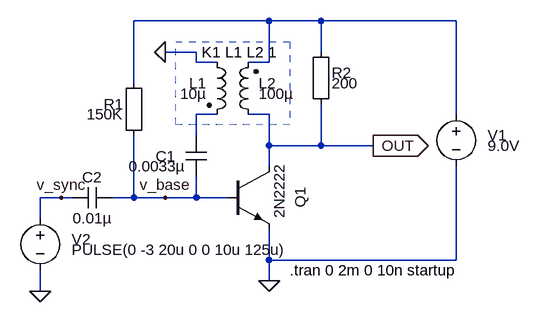
[diagram p0: schematic blocking_oscillator.asc]
blocking_oscillator.asc, the LTspice schematic file:
Version 4
SHEET 1 2412 680
WIRE 0 -1200 -208 -1200
WIRE 80 -1200 0 -1200
WIRE 288 -1200 80 -1200
WIRE -112 -1152 -160 -1152
WIRE 80 -1152 80 -1200
WIRE -112 -1136 -112 -1152
WIRE -80 -1136 -112 -1136
WIRE 0 -1136 0 -1200
WIRE 0 -1136 -32 -1136
WIRE -208 -1104 -208 -1200
WIRE -80 -1056 -112 -1056
WIRE 0 -1056 -32 -1056
WIRE 288 -1056 288 -1200
WIRE -112 -1024 -112 -1056
WIRE 0 -1008 0 -1056
WIRE 80 -1008 80 -1072
WIRE 80 -1008 0 -1008
WIRE 160 -1008 80 -1008
WIRE 0 -976 0 -1008
WIRE -320 -928 -352 -928
WIRE -304 -928 -320 -928
WIRE -208 -928 -208 -1024
WIRE -208 -928 -240 -928
WIRE -160 -928 -208 -928
WIRE -112 -928 -112 -960
WIRE -112 -928 -160 -928
WIRE -64 -928 -112 -928
WIRE -352 -896 -352 -928
WIRE 0 -832 0 -880
WIRE 288 -832 288 -976
WIRE 288 -832 0 -832
WIRE 0 -800 0 -832
WIRE -352 -784 -352 -816
FLAG 0 -800 0
FLAG 160 -1008 OUT
IOPIN 160 -1008 Out
FLAG -160 -1152 0
FLAG -160 -928 v_base
FLAG -352 -784 0
FLAG -320 -928 v_sync
SYMBOL voltage 288 -1072 R0
WINDOW 0 48 48 Left 2
WINDOW 3 48 64 Left 2
WINDOW 123 0 0 Left 2
WINDOW 39 0 0 Left 2
SYMATTR InstName V1
SYMATTR Value 9.0V
SYMBOL cap -128 -1024 R0
WINDOW 0 -16 32 Right 2
WINDOW 3 0 48 Right 2
SYMATTR InstName C1
SYMATTR Value 0.0033µ
SYMATTR SpiceLine V=16 Irms=182m Rser=1.32431 Lser=0 mfg="KEMET" pn="C0402C332K4RAC" type="X7R"
SYMBOL Misc\\EuropeanResistor -192 -1008 R180
WINDOW 0 32 64 Left 2
WINDOW 3 32 48 Left 2
SYMATTR InstName R1
SYMATTR Value 150K
SYMATTR SpiceLine tol=1 pwr=0.1
SYMBOL npn -64 -976 R0
WINDOW 0 112 64 VLeft 2
WINDOW 3 80 80 VLeft 2
SYMATTR InstName Q1
SYMATTR Value 2N2222
SYMBOL ind2 -96 -1152 R0
WINDOW 0 0 48 Right 2
WINDOW 3 0 64 Right 2
SYMATTR InstName L1
SYMATTR Value 10µ
SYMATTR Type ind
SYMBOL ind2 -16 -1040 R180
WINDOW 0 0 64 Right 2
WINDOW 3 0 48 Right 2
SYMATTR InstName L2
SYMATTR Value 100µ
SYMBOL Misc\\EuropeanResistor 96 -1056 R180
WINDOW 0 0 64 Right 2
WINDOW 3 0 48 Right 2
SYMATTR InstName R2
SYMATTR Value 200
SYMATTR SpiceLine tol=1 pwr=0.1
SYMBOL cap -240 -944 R90
WINDOW 0 0 32 VBottom 2
WINDOW 3 32 32 VTop 2
SYMATTR InstName C2
SYMATTR Value 0.01µ
SYMATTR SpiceLine V=16 Irms=647m Rser=0.0322889 Lser=0 mfg="KEMET" pn="C0201C103K4PAC" type="X5R"
SYMBOL voltage -352 -912 R0
WINDOW 0 48 48 Left 2
WINDOW 3 48 64 Left 2
WINDOW 123 0 0 Left 2
WINDOW 39 0 0 Left 2
SYMATTR InstName V2
SYMATTR Value PULSE(0 -3 20u 0 0 10u 125u)
TEXT 32 -816 Left 2 !.tran 0 2m 0 10n startup
TEXT -104 -1152 Left 2 !K1 L1 L2 1
RECTANGLE Normal 32 -1040 -144 -1168 2

The netlist it stands for:
* blocking_oscillator.asc
V1 N001 0 9.0V
C1 N002 v_base 0.0033µ V=16 Irms=182m Rser=1.32431 Lser=0 mfg="KEMET" pn="C0402C332K4RAC" type="X7R"
R1 v_base N001 150K tol=1 pwr=0.1
Q1 OUT v_base 0 0 2N2222
L1 0 N002 10µ
L2 OUT N001 100µ
R2 OUT N001 200 tol=1 pwr=0.1
C2 v_base v_sync 0.01µ V=16 Irms=647m Rser=0.0322889 Lser=0 mfg="KEMET" pn="C0201C103K4PAC" type="X5R"
V2 v_sync 0 PULSE(0 -3 20u 0 0 10u 125u)
.model NPN NPN
.model PNP PNP
.lib standard.bjt
.tran 0 2m 0 10n startup
K1 L1 L2 1
.backanno
.end